# EasyEDA Pro project 赛博樱花灯.epro, board PCB1
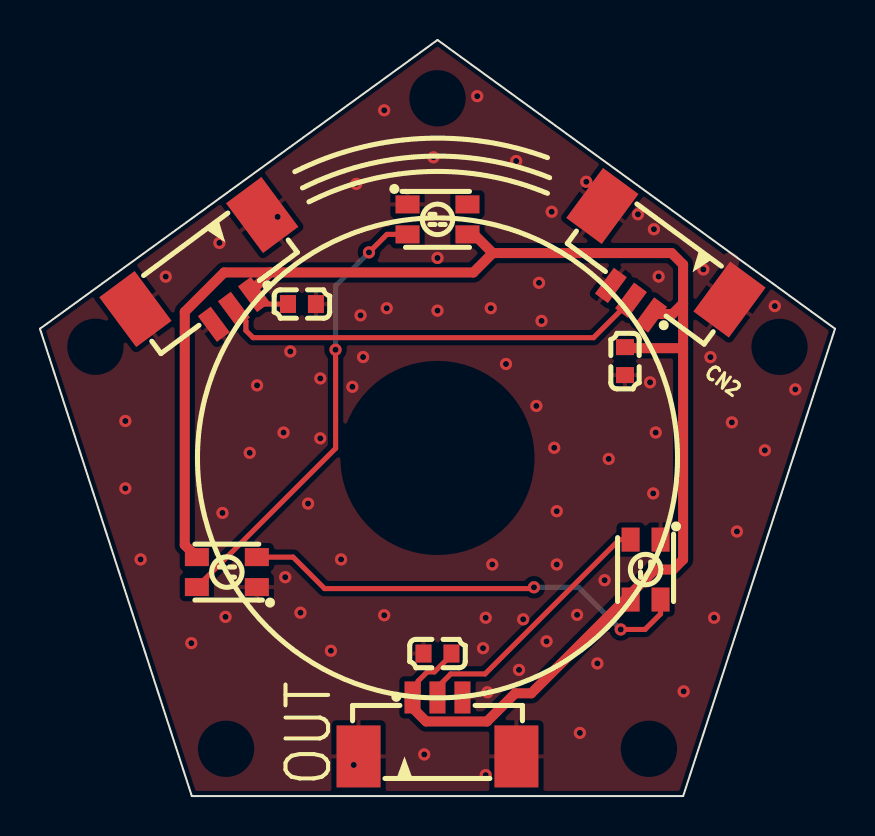
[diagram p8: board, top side]
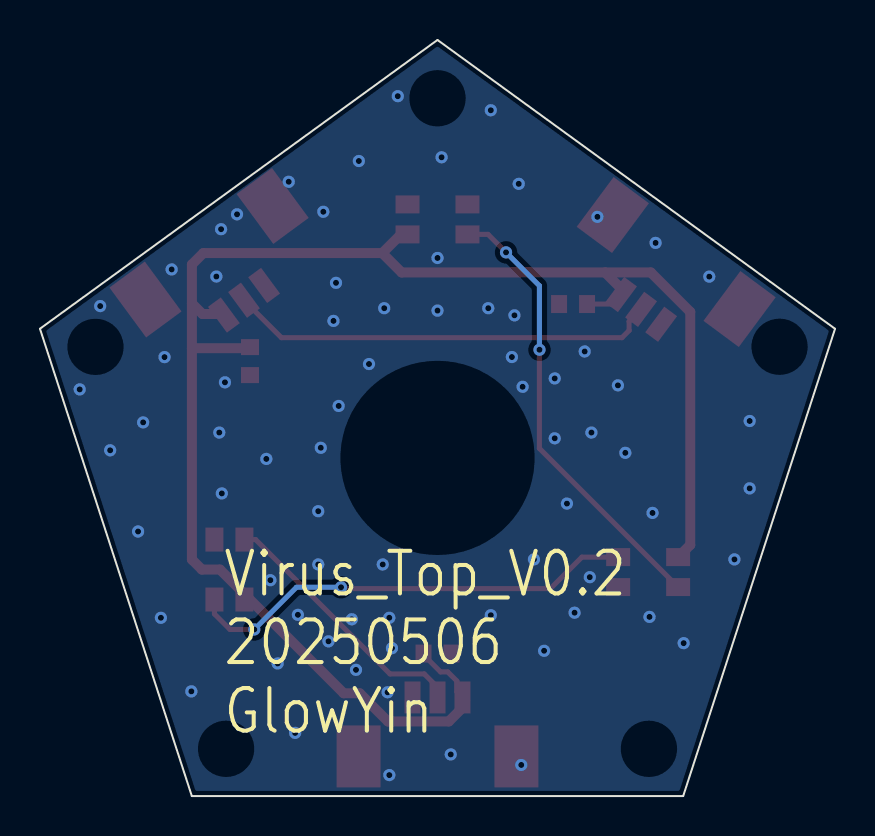
[diagram p9: board, bottom side, seen from below]

Outline 39.79 x 37.84 mm; copper layers: Top Layer, Bottom Layer. Coordinates in mm from the lower left corner of the outline.
Outline path: 0,23.39 19.89,37.84 39.79,23.39 32.19,0 7.6,0 0,23.39
Stack: Top Layer 0.035mm / Dielectric1 1.51mm FR4 er 4.5 / Bottom Layer 0.035mm

## Design rules (mm)
template: JLCPCB Capability(Two Layers Board)
spacing copperThickness1oz (default): track to track 0.102, other pairs 0.152 to 0.3
spacing copperThickness2oz: track to track 0.203, other pairs 0.152 to 0.3
track width copperThickness1oz (default): min 0.127, default 0.254, max 2.54
track width copperThickness2oz: min 0.203, default 0.254, max 2.54
differential pair differentialPair (default): width min 0.127, default 0.254, max 2.54; gap min 0.152, default 0.152
via viaSize (default): diameter min 0.5, default 0.61, max 10; hole min 0.3, default 0.305, max 6.3

## Placement (name value [footprint] x y rotation side)
C220  100nF  [C0603]  29.28 21.77 90 top
C221  100nF  [C0603]  13.11 24.62 180 top
C222  100nF  [C0603]  19.89 7.13 0 top
CN1  HCZZ0015-3  [CONN-SMD_3P-P1.25-L3.3-W8.8]  8.83 25.54 216.6 top
CN2  HCZZ0015-3  [CONN-SMD_3P-P1.25-L3.3-W8.8#2]  30.45 26 143.7 top
CN3  HCZZ0015-3  [CONN-SMD_3P-P1.25-L3.3-W8.8#2]  19.89 3.46 0 top
LED1  XL-3528RGBW-WS2812B  [LED-SMD_4P-L3.5-W2.8-BR-1]  30.31 11.34 90 top
LED2  XL-3528RGBW-WS2812B  [LED-SMD_4P-L3.5-W2.8-BR-1]  9.35 11.21 0 top
LED3  XL-3528RGBW-WS2812B  [LED-SMD_4P-L3.5-W2.8-BR-1]  19.89 28.86 180 top

## Footprints (pads in the part's own frame, mm; a bottom-side part is the same pattern mirrored in y, then rotated)
C0603
  rect 0.8x0.9 smd: 1(-0.7,0) 2(0.7,0)
CONN-SMD_3P-P1.25-L3.3-W8.8
  rect 0.8x1.6 smd: 1(-1.25,1.475) 2(0,1.475) 3(1.25,1.475)
  rect 2.2x3.1 smd: 4(3.95,-1.475) 5(-3.95,-1.475)
CONN-SMD_3P-P1.25-L3.3-W8.8#2
  rect 0.8x1.6 smd: 1(-1.25,1.475) 2(0,1.475) 3(1.25,1.475)
  rect 2.2x3.1 smd: 4(3.95,-1.475) 5(-3.95,-1.475)
LED-SMD_4P-L3.5-W2.8-BR-1
  rect 1.2x0.9 smd: 1(1.5,-0.75) 2(1.5,0.75) 3(-1.5,0.75) 4(-1.5,-0.75)

## Nets
As in the schematic.

Pads without a net: LED3 4

## Via types
v1: diameter 0.61, hole 0.305, Top Layer to Bottom Layer, 76 vias

## Routing (per net, layer and track width the routed paths; a pad name or vN(x,y) marks a point on that pad's centre or on a via; arc(x,y) is an arc through that point)
GND:
  vias: v1(4.27,18.77) v1(4.27,15.4) v1(5.04,11.84) v1(6.3,26) v1(7.58,7.65) v1(8.98,27.68) v1(9.13,14.17) v1(9.29,8.97) v1(10.5,17.18) v1(10.87,20.55) v1(11.89,28.99) v1(12.19,18.19) v1(12.27,10.95) v1(12.53,22.25) v1(13.04,9.18) v1(13.42,14.64) v1(14.03,20.9) v1(14.03,17.9) v1(14.56,7.27) v1(15.07,11.84) v1(15.64,20.48) v1(15.7,1.56) v1(15.83,30.64) v1(16.04,24.06) v1(16.17,21.97) v1(17.23,34.32) v1(17.23,9.05) v1(17.35,24.42) v1(19.23,2.08) v1(19.69,31.97) v1(19.89,26.93) v1(19.89,24.3) v1(21.88,35.03) v1(22.17,7.4) v1(22.31,8.92) v1(22.31,1.05) v1(22.39,5.19) v1(22.56,24.42) v1(22.64,11.59) v1(23.32,21.62) v1(23.83,31.78) v1(23.97,6.31) v1(24.18,8.85) v1(24.84,19.52) v1(24.97,25.69) v1(25.1,23.78) v1(25.35,7.74) v1(25.61,29.24) v1(25.74,17.43) v1(25.86,14.26) v1(25.86,11.59) v1(26.88,9.07) v1(27.02,3.16) v1(27.34,30.74) v1(27.9,6.64) v1(28.26,10.8) v1(28.46,16.87) v1(29.93,29.11) v1(30.53,20.71) v1(30.73,28.37) v1(30.69,15.14) v1(30.82,18.19) v1(30.96,26) v1(32.21,5.24) v1(33.2,26.36) v1(33.56,21.97) v1(33.74,8.92) v1(34.63,18.7) v1(34.88,13.24) v1(36.28,17.3) v1(36.78,24.52) v1(37.8,20.35)
VCC: length 84.6
  Top Layer w0.254: CN3.1 18.93,5.21 18.93,5.76 19.38,6.21 19.74,6.21 20.59,7.07 C222.2 ; 10.56,25.25 11.19,24.62 12.41,24.62
  Top Layer w0.5: 30.64,24.12 31.66,24.12 32.19,24.66 ; LED3.3 21.72,28.11 22.66,27.17 ; 32.19,22.41 32.19,24.66 ; 32.19,22.41 29.13,22.41 ; 32.19,22.41 32.19,11.84 31.69,11.34 30.78,11.34 24.59,5.14 23.78,5.14 22.37,3.73 19.33,3.73 18.52,4.54 18.52,4.81 CN3.1 ; 32.19,24.66 32.19,26.6 31.61,27.17 22.66,27.17 ; LED2.3 7.25,12.56 7.25,24.23 9.22,26.2 11.51,26.2 ; 22.66,27.17 21.69,26.2 11.51,26.2 ; 11.51,26.2 10.56,25.25
$1N828: length 22.8
  Top Layer w0.254: v1(24.72,10.45) 24.66,10.38 14.24,10.38 12.67,11.96 LED2.2 ; v1(29.06,8.34) 30.28,8.34 31.06,9.11 LED1.4
  Bottom Layer w0.254: v1(29.06,8.34) 26.95,10.45 v1(24.72,10.45)
$1N837: length 22.6
  Top Layer w0.254: LED3.2 17.37,28.11 v1(16.47,27.21) ; v1(14.79,22.34) 14.79,21.92 14.8,21.91 14.8,17.4 LED2.4
  Bottom Layer w0.254: v1(14.79,22.34) 14.79,22.34 14.79,25.54 v1(16.47,27.21)
$1N1037: length 21.8
  Top Layer w0.254: 29.63,24.87 27.7,22.94 10.66,22.94 10.31,23.3 10.31,23.76 9.55,24.51
$1N1096: length 13.2
  Top Layer w0.254: LED1.2 29,12.84 22.27,6.11 20.56,6.11 19.89,5.45 CN3.2

## Copper pours and planes (outline as drawn; the poured copper is in the pictures)
GND on Top Layer: -2.58,38.77 40.98,38.77 40.98,-2.38 -2.58,-2.38
GND on Bottom Layer: -1.82,38.64 41.61,38.64 41.61,-2.13 -1.82,-2.13

## Text on the board
Bottom Silkscreen Layer: Virus_Top_V0.2 / 20250506 / GlowYin
Top Silkscreen Layer: OUT
